# Altium schematic sheet Sheet6_MCU_Antenna_Radio_Interface.SchDoc
size A; SheetNumber: 6; SheetTotal: 6
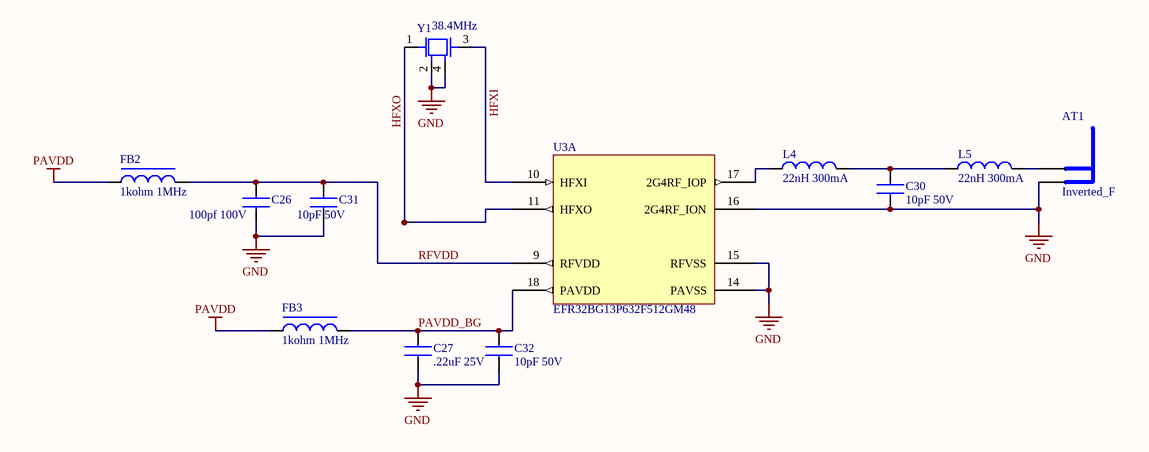
[diagram p0: Sheet6_MCU_Antenna_Radio_Interface.SchDoc]

## Parts
AT1  Inverted_F  [F_ANTENNA]  (net tie, no BOM)
C26  100pf 100V  [CAP_0805_1_4MM]
C27  .22uF 25V  [CAP_0603_1MM]
C30  10pF 50V  [CAPC1005X06N]
C31  10pF 50V  [CAP_0805_1_4MM]
C32  10pF 50V  [CAP_0805_1_4MM]
FB2  1kohm 1MHz  [CAP_0603_1MM]
FB3  1kohm 1MHz  [CAP_0603_1MM]
L4  22nH 300mA  [INDC1005X06N]
L5  22nH 300mA  [INDC1005X06N]
U3  EFR32BG13P632F512GM48  [QFN50P700X700X90_HS-49N]  (part A of 7)
Y1  38.4MHz  [DFN130P200X45-4N]

## Nets
GND: AT1.GND C26.2 C27.2 C30.2 C31.2 C32.2 U3.14(PAVSS) U3.15(RFVSS) U3.16(2G4RF_ION) Y1.2 Y1.4
PAVDD: FB2.1 FB3.1
HFXI: U3.10(HFXI) Y1.3
HFXO: U3.11(HFXO) Y1.1
PAVDD_BG: C27.1 C32.1 FB3.2 U3.18(PAVDD)
RFVDD: C26.1 C31.1 FB2.2 U3.9(RFVDD)
NetAT1_FEED: AT1.FEED L5.2
NetC30_1: C30.1 L4.2 L5.1
NetL4_1: L4.1 U3.17(2G4RF_IOP)

## Library data of the parts
AT1 = INVERTED-F_ANTENNA: Inverted-F Antenna for .062" FR4
C26 = CL21C101JCANNNC: Capacitor 100 pF 100 VDC PU=4000 ST, CL21C101JCANNNC, Samsung; Material: Ceramic; Tolerance: 5%; Dielectric: C0G; Temperature Coefficient: 300ppm/°C; Supplier 1: Digi-Key; Manufacturer: Samsung; Manufacturer Part Number: CL21C101JCANNNC; RoHS: Yes; Category: Ceramic Capacitors; Stock 1: 199319; Pricing 1: 1=0.10000, 10=0.04500, 50=0.02440, 100=0.02000, 500=0.01428, 1000=0.01122 (USD); Mount: Surface Mount; Case/Package: 0805; Case Code (Metric): 2012; Case Code (Imperial): 0805; Contact Plating: Tin; Min Operating Temperature: -55°C; Max Operating Temperature: 125°C; Capacitance: 100pF; Voltage Rating: 100V; Package Quantity: 1; Packaging: Tape and Reel; Voltage: 100V; Series: CL; Construction: Flat; Length: 2mm; Width: 0.049inch; Height: 0.65mm; Depth: 1.25mm; Thickness: 0.03inch; Radiation Hardening: No; RoHS Compliant: Yes; ComponentLink1URL: https://datasheet.ciiva.com/15195/getdatasheetpartid-543198-15195932.pdf?src-supplier=Verical; ComponentLink1Description: https://datasheet.ciiva.com/15195/getdatasheetpartid-543198-15195932.pdf?src-supplier=Verical; ComponentLink2URL: https://datasheet.ciiva.com/29199/454055-da-01-en-vs-kondensator-0805-29199890.pdf?src-supplier=Conrad; ComponentLink2Description: https://datasheet.ciiva.com/29199/454055-da-01-en-vs-kondensator-0805-29199890.pdf?src-supplier=Conrad; ComponentLink3URL: https://datasheet.ciiva.com/26310/mlcc-catalogdownload2013-eng-26310191.pdf?src-supplier=Distrelec; ComponentLink3Description: https://datasheet.ciiva.com/26310/mlcc-catalogdownload2013-eng-26310191.pdf?src-supplier=Distrelec
C27 = TMK107B7224KA-T: TAIYO YUDEN - TMK107B7224KA-T - SMD Multilayer Ceramic Capacitor, 0.22 µF, 25 V, 0603 [1608 Metric], ± 10%, X7R, M Series; Capacitance: 220nF; Supplier 1: Digi-Key; Manufacturer: Taiyo Yuden; Manufacturer Part Number: TMK107B7224KA-T; RoHS: Yes; Category: Ceramic Capacitors; Stock 1: 362990; Pricing 1: 1=0.11000, 10=0.07600, 50=0.04340, 100=0.03590, 500=0.02516, 1000=0.02083 (USD); Mount: Surface Mount; Case/Package: 0603; Case Code (Imperial): 0603; Case Code (Metric): 1608; Min Operating Temperature: -55°C; Max Operating Temperature: 125°C; Packaging: Tape and Reel; Tolerance: 10%; Voltage Rating: 25V; Package Quantity: 1; Voltage Rating (DC): 25V; Dielectric: X7R; Termination: SMD/SMT; Resistor Type: Ceramic; Series: M; Construction: Flat; Length: 1.6mm; Width: 0.8mm; Height: 0.8mm; Thickness: 0.035inch; Depth: 0.8mm; Radiation Hardening: No; REACH SVHC: Unknown; RoHS Compliant: Yes; ComponentLink1URL: https://datasheet.ciiva.com/30146/emultilayer-ceramic-capacitor-30146647.pdf?src-supplier=Onlinecomponents.com; ComponentLink1Description: https://datasheet.ciiva.com/30146/emultilayer-ceramic-capacitor-30146647.pdf?src-supplier=Onlinecomponents.com; ComponentLink2URL: https://datasheet.ciiva.com/7975/746258-7975850.pdf?src-supplier=Element14; ComponentLink2Description: https://datasheet.ciiva.com/7975/746258-7975850.pdf?src-supplier=Element14; ComponentLink3URL: https://datasheet.ciiva.com/132/mlcc-all-e-132763.pdf?src-supplier=Digi-Key; ComponentLink3Description: https://datasheet.ciiva.com/132/mlcc-all-e-132763.pdf?src-supplier=Digi-Key; ComponentLink4URL: https://datasheet.ciiva.com/28645/746258-28645259.pdf?src-supplier=Element14; ComponentLink4Description: https://datasheet.ciiva.com/28645/746258-28645259.pdf?src-supplier=Element14; ComponentLink5URL: https://datasheet.ciiva.com/30209/emultilayer-ceramic-capacitor-30209147.pdf?src-supplier=Onlinecomponents.com; ComponentLink5Description: https://datasheet.ciiva.com/30209/emultilayer-ceramic-capacitor-30209147.pdf?src-supplier=Onlinecomponents.com; ComponentLink6URL: https://datasheet.ciiva.com/132/mlcc-all-e-132764.pdf?src-supplier=Digi-Key; ComponentLink6Description: https://datasheet.ciiva.com/132/mlcc-all-e-132764.pdf?src-supplier=Digi-Key; ComponentLink7URL: https://datasheet.ciiva.com/132/mlcc-all-e-132765.pdf?src-supplier=Digi-Key; ComponentLink7Description: https://datasheet.ciiva.com/132/mlcc-all-e-132765.pdf?src-supplier=Digi-Key; ComponentLink8URL: https://datasheet.ciiva.com/15922/emultilayer-ceramic-capacitor-15922381.pdf?src-supplier=Onlinecomponents.com; ComponentLink8Description: https://datasheet.ciiva.com/15922/emultilayer-ceramic-capacitor-15922381.pdf?src-supplier=Onlinecomponents.com
C30-C32 = C0402C100K5RAC7867: Cap Ceramic 10pF 50V X7R 10% SMD 0402 125°C Paper T/R; Manufacturer: KEMET; Supplier 1: Digi-Key; Manufacturer Part Number: C0402C100K5RAC7867; Stock 1: 20482; Pricing 1: 1=0.10000, 10=0.06000, 50=0.03300, 100=0.02700, 500=0.01924, 1000=0.01512, 2500=0.01375, 5000=0.01265 (USD); RoHS Compliant: Yes; ComponentLink1URL: http://datasheet.octopart.com/C0402C100K5RAC7867-KEMET-datasheet-84169754.pdf; ComponentLink1Description: http://datasheet.octopart.com/C0402C100K5RAC7867-KEMET-datasheet-84169754.pdf
FB2 FB3 = 74279266: WURTH ELEKTRONIK - 74279266 - Ferrite Bead, 0603 [1608 Metric], 1 kohm, 200 mA, WE-CBF Series, 0.6 ohm, ± 25%; Manufacturer: Wurth Electronics; Impedance: 1kR; Max DC Current: 200mA; DC Resistance (DCR): 600mR; Test Frequency: 100MHz; Number of Lines: 1; Inductance: 1.8nH; Shielding: Unshielded; Supplier 1: Digi-Key; Manufacturer Part Number: 74279266; RoHS: Yes; Category: Ferrite Beads and Chips; Stock 1: 78275; Pricing 1: 1=0.17000, 50=0.16800, 100=0.15500, 500=0.14800, 1000=0.14100, 2000=0.13400 (USD); Case/Package: SMD/SMT; Case Code (Metric): 1608; Case Code (Imperial): 0603; Core Material: Ferrite; Min Operating Temperature: -55°C; Max Operating Temperature: 125°C; Tolerance: 25%; Packaging: Tape and Reel; Termination: SMD/SMT; Max Current Rating: 200mA; Current Rating: 200mA; Series: WE-CBF; Length: 1.6mm; Width: 0.8mm; Height: 0.8mm; Depth: 0.8mm; Lead Free: Lead Free; REACH SVHC: Unknown; RoHS Compliant: Yes; ComponentLink1URL: https://datasheet.ciiva.com/14634/0900766b801ef1d0-14634816.pdf?src-supplier=Allied+Electronics; ComponentLink1Description: https://datasheet.ciiva.com/14634/0900766b801ef1d0-14634816.pdf?src-supplier=Allied+Electronics; ComponentLink2URL: https://datasheet.ciiva.com/23763/74279266-23763009.pdf?src-supplier=Newark; ComponentLink2Description: https://datasheet.ciiva.com/23763/74279266-23763009.pdf?src-supplier=Newark; ComponentLink3URL: https://datasheet.ciiva.com/11799/0900766b801ef1d0-11799352.pdf?src-supplier=RSComponents; ComponentLink3Description: https://datasheet.ciiva.com/11799/0900766b801ef1d0-11799352.pdf?src-supplier=RSComponents; ComponentLink4URL: https://datasheet.ciiva.com/14971/74279266-14971192.pdf?src-supplier=Digi-Key; ComponentLink4Description: https://datasheet.ciiva.com/14971/74279266-14971192.pdf?src-supplier=Digi-Key; ComponentLink5URL: https://datasheet.ciiva.com/12395/74279266-221135-12395453.pdf?src-supplier=Mouser; ComponentLink5Description: https://datasheet.ciiva.com/12395/74279266-221135-12395453.pdf?src-supplier=Mouser; ComponentLink6URL: https://datasheet.ciiva.com/1466/1705901-1466509.pdf?src-supplier=Element14; ComponentLink6Description: https://datasheet.ciiva.com/1466/1705901-1466509.pdf?src-supplier=Element14; ComponentLink7URL: https://datasheet.ciiva.com/22711/1705901-22711422.pdf?src-supplier=Element14; ComponentLink7Description: https://datasheet.ciiva.com/22711/1705901-22711422.pdf?src-supplier=Element14; ComponentLink8URL: https://datasheet.ciiva.com/48698/001087059-da-01-ml-we-cbf-smd-ferrit-74279266-de-en-48698427.pdf?src-supplier=Conrad; ComponentLink8Description: https://datasheet.ciiva.com/48698/001087059-da-01-ml-we-cbf-smd-ferrit-74279266-de-en-48698427.pdf?src-supplier=Conrad
L4 L5 = LQG15HS22NJ02D: Fixed Inductors 22nH 5% Hi-Freq; Manufacturer: Murata; Core Material: Air; DC Resistance (DCR): 420mR; Q Factor: 8; Shielding: Unshielded; Self Resonant Frequency: 1.9GHz; Test Frequency: 100MHz; Supplier 1: Digi-Key; Manufacturer Part Number: LQG15HS22NJ02D; RoHS: Yes; Category: Fixed Inductors; Stock 1: 109500; Pricing 1: 1=0.10000, 10=0.05300, 25=0.04680, 50=0.03980, 100=0.03510, 250=0.03216, 500=0.02924, 1000=0.02457, 2500=0.02106 (USD); Mount: Surface Mount; Case/Package: 0402; Case Code (Metric): 1005; Case Code (Imperial): 0402; Min Operating Temperature: -55°C; Max Operating Temperature: 125°C; Tolerance: 5%; Inductance: 22nH; Max DC Current: 300mA; Package Quantity: 10000; Packaging: Tape and Reel; Current Rating: 300mA; Termination: SMD/SMT; DC Current: 300mA; Series: LQG15HS; Rated Current-Max: 300mA; Length: 1mm; Width: 0.02inch; Height: 0.5mm; Height - Seated (Max): 0.022inch; Depth: 0.55mm; Radiation Hardening: No; Military Standard: Not; Lead Free: Lead Free; RoHS Compliant: Yes; ComponentLink1URL: https://datasheet.ciiva.com/11801/0900766b80f10809-11801427.pdf?src-supplier=RSComponents; ComponentLink1Description: https://datasheet.ciiva.com/11801/0900766b80f10809-11801427.pdf?src-supplier=RSComponents; ComponentLink2URL: https://datasheet.ciiva.com/18088/getdatasheetpartid-55811-18088843.pdf?src-supplier=Verical; ComponentLink2Description: https://datasheet.ciiva.com/18088/getdatasheetpartid-55811-18088843.pdf?src-supplier=Verical; ComponentLink3URL: https://datasheet.ciiva.com/1038/l0075s0083lqg15hs-1038108.pdf?src-supplier=Digi-Key; ComponentLink3Description: https://datasheet.ciiva.com/1038/l0075s0083lqg15hs-1038108.pdf?src-supplier=Digi-Key; ComponentLink4URL: https://datasheet.ciiva.com/3082/l0075s0083lqg15hs-3082178.pdf?src-supplier=Avnet; ComponentLink4Description: https://datasheet.ciiva.com/3082/l0075s0083lqg15hs-3082178.pdf?src-supplier=Avnet; ComponentLink5URL: https://datasheet.ciiva.com/16444/l0075s0083lqg15hs-16444393.pdf?src-supplier=Future+Electronics; ComponentLink5Description: https://datasheet.ciiva.com/16444/l0075s0083lqg15hs-16444393.pdf?src-supplier=Future+Electronics; ComponentLink6URL: https://datasheet.ciiva.com/1038/l0075s0083lqg15hs-1038106.pdf?src-supplier=Digi-Key; ComponentLink6Description: https://datasheet.ciiva.com/1038/l0075s0083lqg15hs-1038106.pdf?src-supplier=Digi-Key; ComponentLink7URL: https://datasheet.ciiva.com/17279/l0075s0083lqg15hs-17279242.pdf?src-supplier=Avnet+Europe; ComponentLink7Description: https://datasheet.ciiva.com/17279/l0075s0083lqg15hs-17279242.pdf?src-supplier=Avnet+Europe; ComponentLink8URL: https://datasheet.ciiva.com/1038/l0075s0083lqg15hs-1038107.pdf?src-supplier=Digi-Key; ComponentLink8Description: https://datasheet.ciiva.com/1038/l0075s0083lqg15hs-1038107.pdf?src-supplier=Digi-Key
U3 = EFR32BG13P732F512GM48-B_1: BLUE PREMIUM QFN48 2.4G 19 DBM B; Manufacturer: Silicon Labs; Interface: I2C,UART,USART; Frequency: 2.4GHz; Data Rate: 2Mbps; Sensitivity: -102dBm; Memory Size: 64KB; Number of GPIO: 31; Current - Receiving: 11mA; Current - Transmitting: 8.5mA; Supplier 1: Digi-Key; Manufacturer Part Number: EFR32BG13P732F512GM48-B; RoHS: Yes; Category: RF Receivers, Transceivers; Stock 1: 19; Pricing 1: 1=6.48000, 25=6.24040, 100=6.00030, 1000=5.98905 (USD); Min Operating Temperature: -40°C; Max Operating Temperature: 85°C; Packaging: Tray; RoHS Compliant: Yes; ComponentLink1URL: https://www.silabs.com/documents/login/data-sheets/efr32bg13-datasheet.pdf?src-supplier=Digi-Key; ComponentLink1Description: https://www.silabs.com/documents/login/data-sheets/efr32bg13-datasheet.pdf?src-supplier=Digi-Key
Y1 = 8Y38472012: Manufacturer: TXC; Supplier 1: Digi-Key; Manufacturer Part Number: 8Y38472012; RoHS: No; Stock 1: 13540; Pricing 1: 1=0.78000, 10=0.69000, 50=0.64500, 100=0.57000, 500=0.54000, 1000=0.45000 (USD)